# EasyEDA schematic SCH_Finger_CLeaner_IC_Controller_2025-11-20.json
TITLE: Finger Cleaner Device Boards; REV: 2; Date: 2025-11-13; Sheet: 1/1; Drawn By: Louis-David G.H.; Company: ECE 411 Team 16
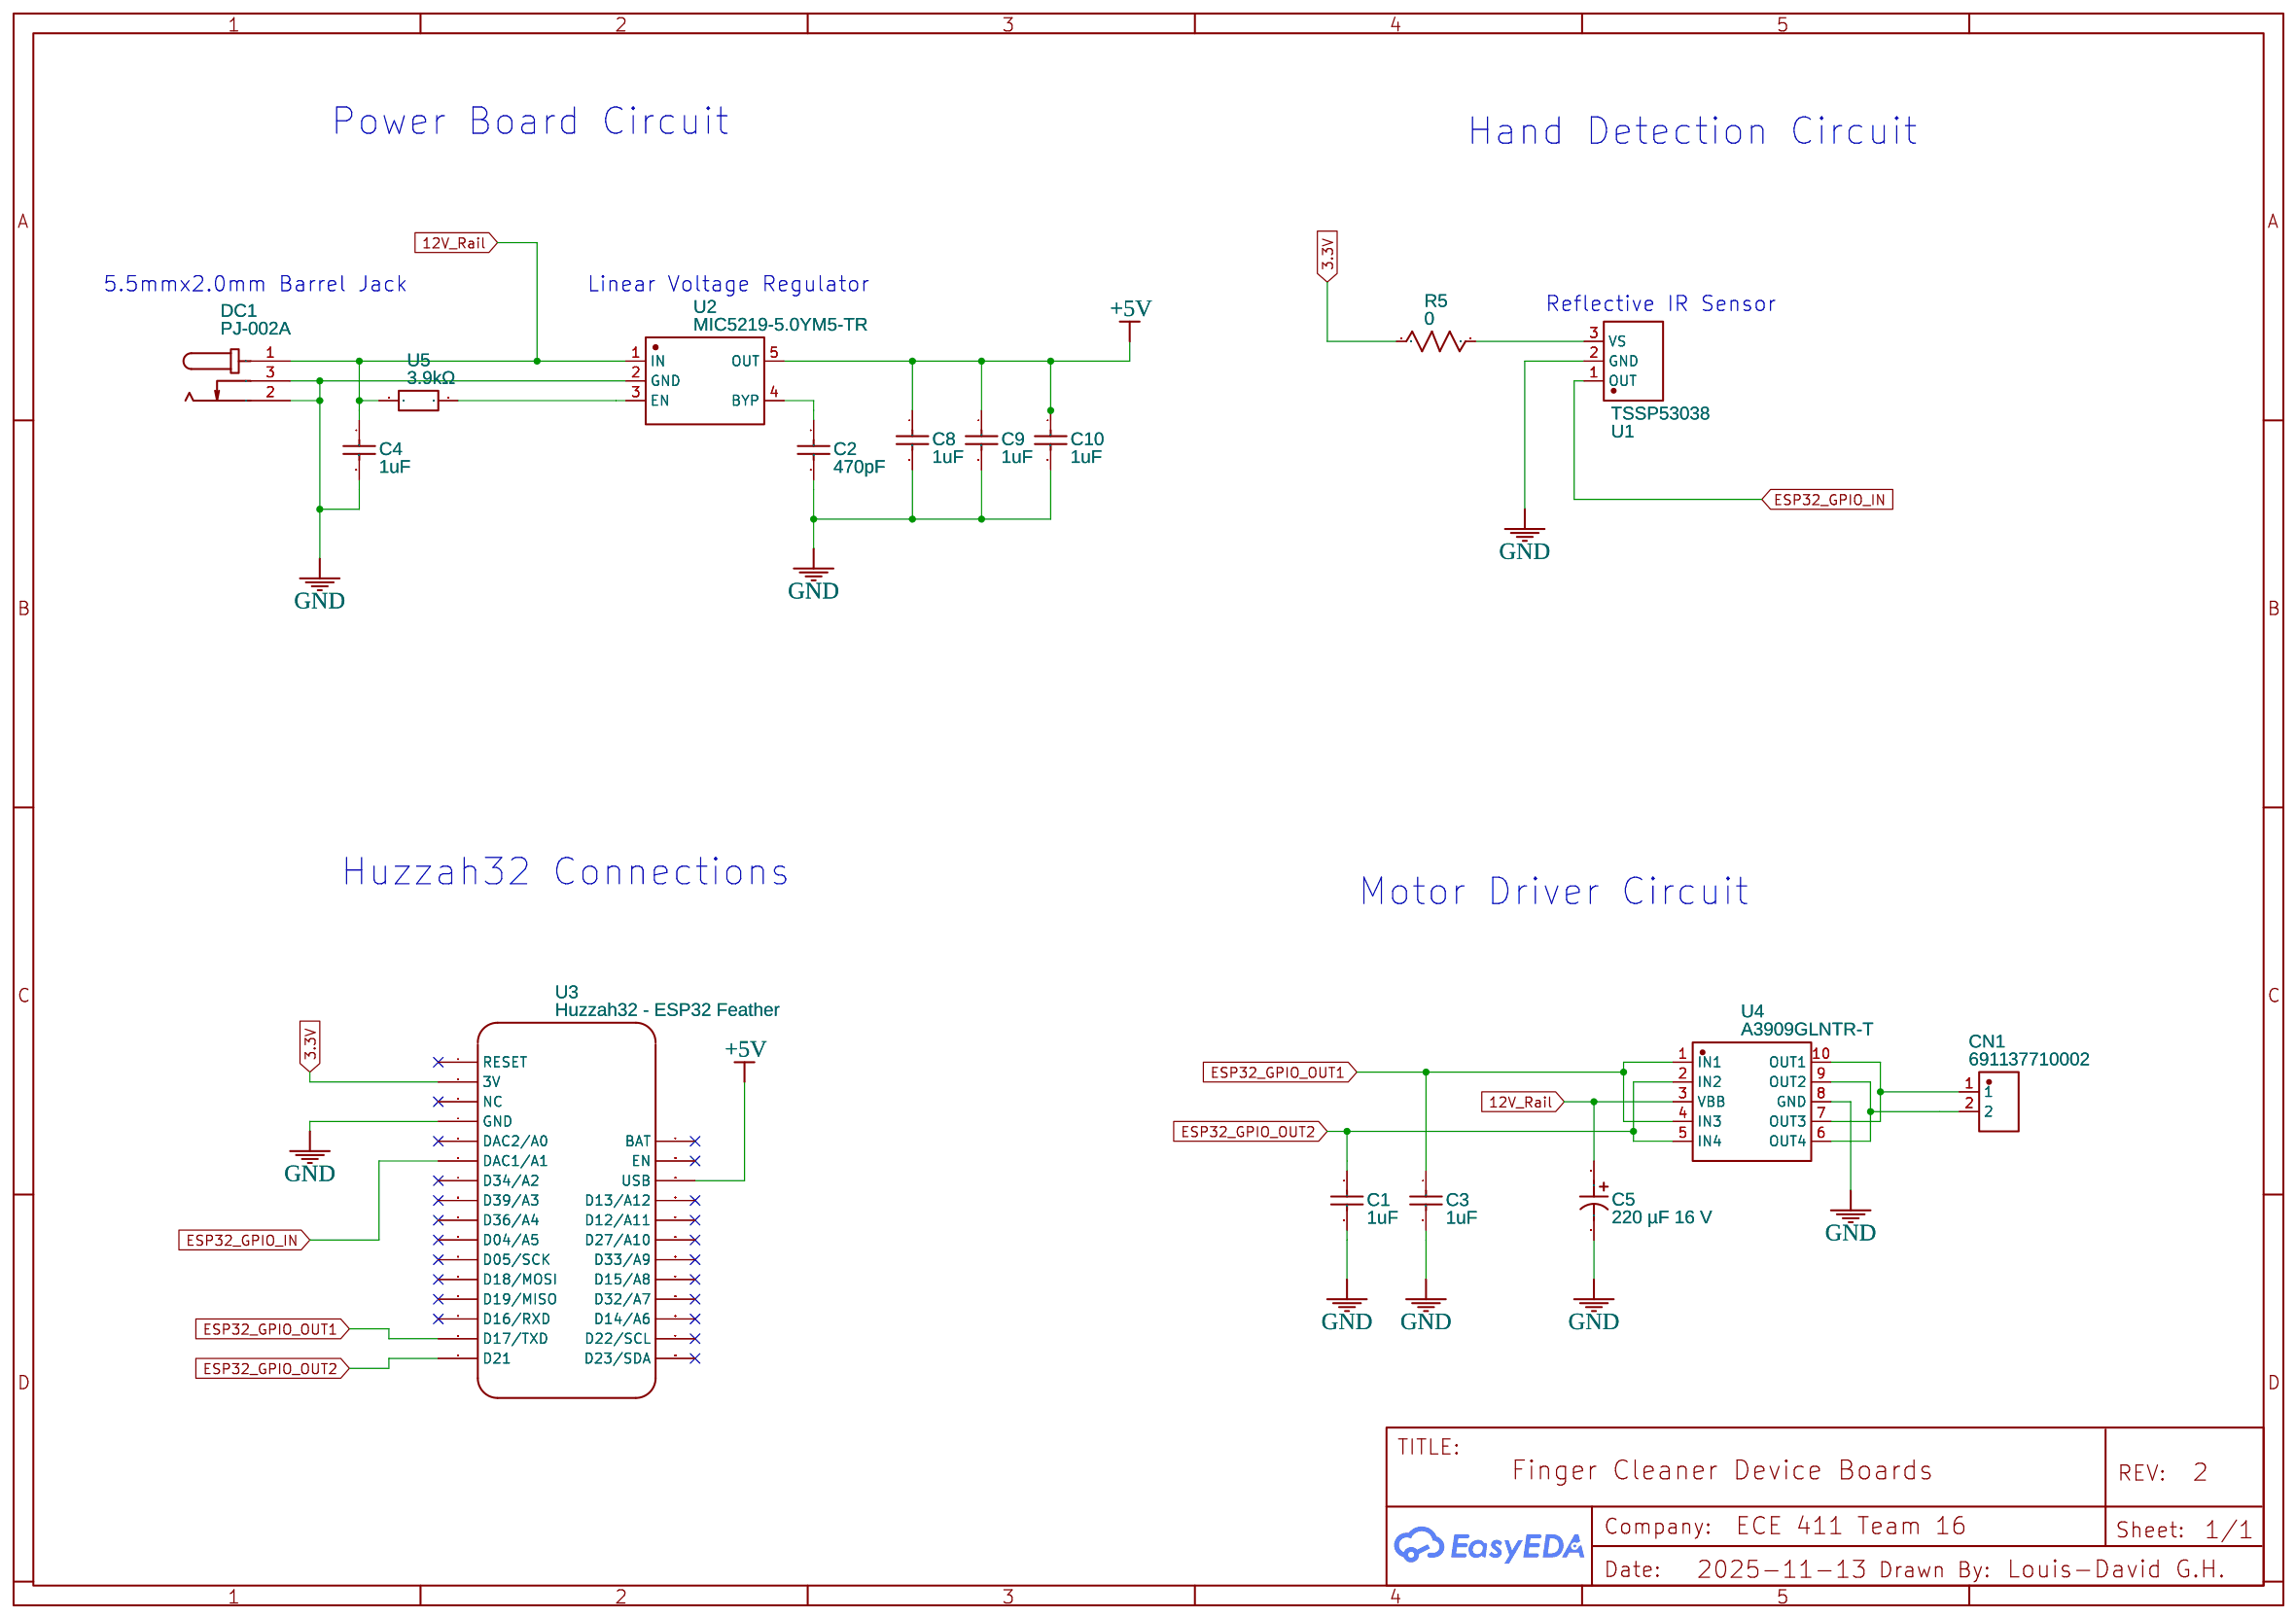
[diagram p0: schematic sheet]

## Parts
C1  1uF  [C0603]
C2  470pF  [C0603]
C3  1uF  [C0603]
C4  1uF  [C0603]
C5  220 µF 16 V  [APXG160ARA221MF80G]
C8  1uF  [C0603]
C9  1uF  [C0603]
C10  1uF  [C0603]
CN1  691137710002  [CONN-TH_2P-P5.00_691137710002]
DC1  PJ-002A  [DC-IN-TH_PJ-002A]
R5  0  [R0603]
U1  TSSP53038  [SENSOR-TH_TSSP93038]
U2  MIC5219-5.0YM5-TR  [SOT-23-5_L3.0-W1.7-P0.95-LS2.8-TL]
U3  Huzzah32 - ESP32 Feather  [HUZZAH32]
U4  A3909GLNTR-T  [SSOP-10_L4.9-W3.9-P1.00-LS6.0-BL]
U5  3.9kΩ  [R0805]

## Library data of the parts
C1 C3 C4 C8-C10 = CL10B105KO8NNNC: Supplier: LCSC; Manufacturer: SAMSUNG(三星); Supplier Part: C59782; JLCPCB Part Class: Extended Part
C2 = CL10C471JB8NNNC: Supplier: LCSC; Manufacturer: SAMSUNG(三星); Supplier Part: C27694; JLCPCB Part Class: Extended Part; Package Display: No
C5 = APXG160ARA221MF80G - 220 µF 16 V: Manufacturer: Chemi-Con; Supplier: Digi-Key; Supplier Part: 565-4283-2-ND; Contributor: jaynandakumar
CN1 = 691137710002: Supplier: LCSC; Supplier Part: C5332011; Manufacturer: Wurth(伍尔特); JLCPCB Part Class: Extended Part; Contributor: lcsc
DC1 = PJ-002A: Supplier: LCSC; Supplier Part: C3096082; Manufacturer: CUI; Contributor: lcsc; JLCPCB Part Class: Extended Part
R5 = R_0603_US: Contributor: LCEDA_Lib
U1 = TSSP53038: Supplier: LCSC; Supplier Part: C20346076; Manufacturer: VISHAY(威世); Contributor: lcsc; JLCPCB Part Class: Extended Part
U2 = MIC5219-5.0YM5-TR: Contributor: LCSC; Supplier: LCSC; Manufacturer: MICROCHIP(美国微芯); Supplier Part: C144182; JLCPCB Part Class: Extended Part
U3 = Huzzah32 - ESP32 Feather: Manufacturer: Adafruit; Manufacturer Part: 3405; Supplier: Mouser; Supplier Part: 485-3405; link: https://www.mouser.com/ProductDetail/Adafruit/3405?qs=sGAEpiMZZMve4%2FbfQkoj%252BL%2FMP7pCYZmkSYGzew1l%252BSY%3D; Contributor: sensar
U4 = A3909GLNTR-T: Contributor: LCSC; Supplier: LCSC; Supplier Part: C2653462; Manufacturer: ALLEGRO(美国埃戈罗); JLCPCB Part Class: Extended Part
U5 = CRCW08053K90FKEAC: Contributor: lcsc; Supplier: LCSC; Supplier Part: C3009418; Manufacturer: VISHAY(威世); JLCPCB Part Class: Extended Part

## Nets
3.3V: R5.1 U3.2(3V)
12V_Rail: C4.1 C5.1 DC1.1 U2.1(IN) U4.3(VBB) U5.1
+5V: C8.1 C9.1 C10.1 U2.5(OUT) U3.19(USB)
GND: C1.2 C2.2 C3.2 C4.2 C5.2 C8.2 C9.2 C10.2 DC1.2 DC1.3 U1.2(GND) U2.2(GND) U3.4(GND) U4.8(GND)
ESP32_GPIO_IN: U1.1(OUT) U3.6(DAC1/A1)
ESP32_GPIO_OUT1: C3.1 U3.15(D17/TXD) U4.1(IN1) U4.4(IN3)
ESP32_GPIO_OUT2: C1.1 U3.16(D21) U4.2(IN2) U4.5(IN4)
Net-(C2-1): C2.1 U2.4(BYP)
Net-(CN1-1): CN1.1 U4.7(OUT3) U4.10(OUT1)
Net-(CN1-2): CN1.2 U4.6(OUT4) U4.9(OUT2)
Net-(R5-2): R5.2 U1.3(VS)
Net-(U2-3): U2.3(EN) U5.2

Not connected (* = marked no-connect by the designer): U3 1(RESET)* 3(NC)* 5(DAC2/A0)* 7(D34/A2)* 8(D39/A3)* 9(D36/A4)* 10(D04/A5)* 11(D05/SCK)* 12(D18/MOSI)* 13(D19/MISO)* 14(D16/RXD)* 17(BAT)* 18(EN)* 20(D13/A12)* 21(D12/A11)* 22(D27/A10)* 23(D33/A9)* 24(D15/A8)* 25(D32/A7)* 26(D14/A6)* 27(D22/SCL)* 28(D23/SDA)*

## Notes on the sheet
- Power Board Circuit
- Hand Detection Circuit
- 5.5mmx2.0mm Barrel Jack
- Linear Voltage Regulator
- Reflective IR Sensor
- Huzzah32 Connections
- Motor Driver Circuit
